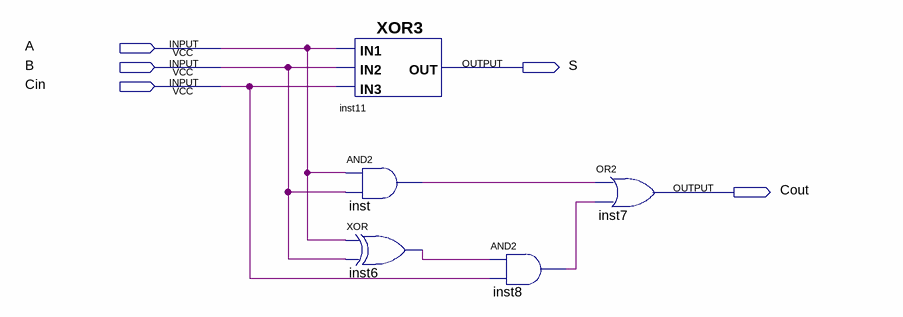
[diagram p0: schematic sheet]
// Quartus schematic FullAdder_1bit.bdf as structural Verilog: 5 symbols, 5 pins
module FullAdder_1bit (
  input  A,
  input  B,
  input  Cin,
  output S,
  output Cout
);

  wire inst6_out, inst8_out, inst_out;

  XOR3 inst11 (.IN3(Cin), .IN1(A), .IN2(B), .OUT(S));
  and inst (inst_out, A, B);
  xor inst6 (inst6_out, A, B);
  and inst8 (inst8_out, inst6_out, Cin);
  or inst7 (Cout, inst_out, inst8_out);
endmodule
